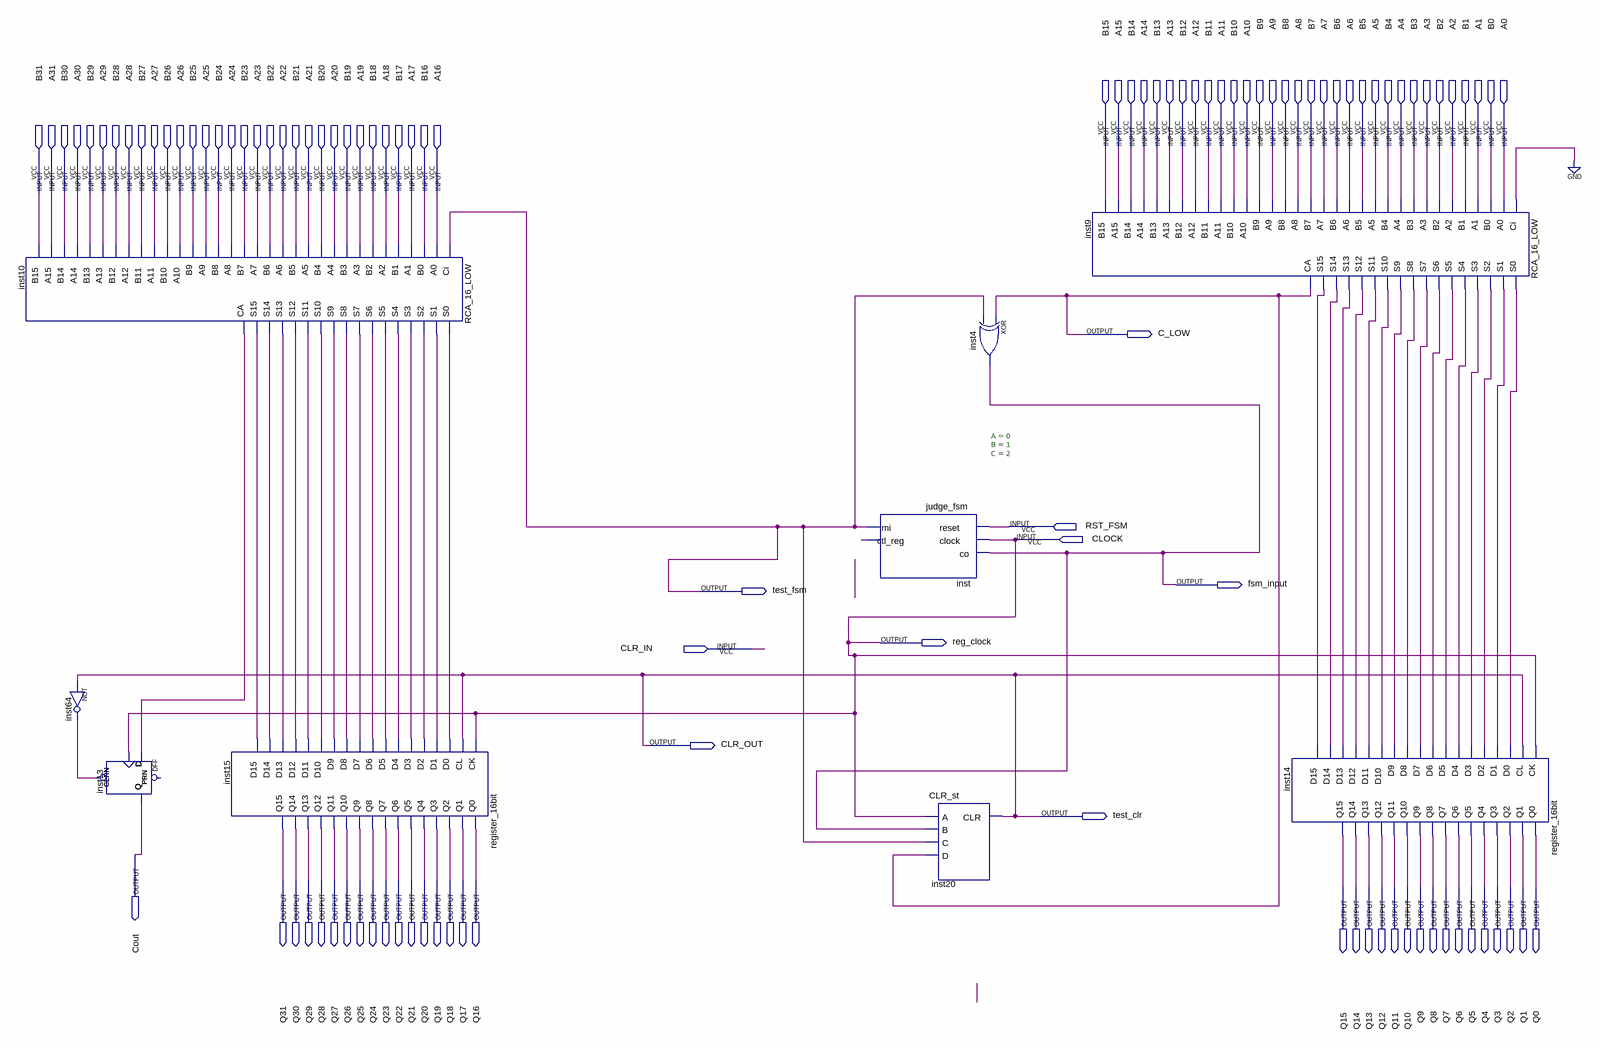
[diagram p0: schematic sheet]
// Quartus schematic test.bdf as structural Verilog: 9 symbols, 106 pins
module test (
  input  B15,
  input  A15,
  input  B14,
  input  A14,
  input  B13,
  input  A13,
  input  B12,
  input  A12,
  input  B11,
  input  A11,
  input  B10,
  input  A10,
  input  B9,
  input  A9,
  input  B8,
  input  A8,
  input  B7,
  input  A7,
  input  B6,
  input  A6,
  input  B5,
  input  A5,
  input  B4,
  input  A4,
  input  B3,
  input  A3,
  input  B2,
  input  A2,
  input  B1,
  input  A1,
  input  B0,
  input  A0,
  input  B31,
  input  A31,
  input  B30,
  input  A30,
  input  B29,
  input  A29,
  input  B28,
  input  A28,
  input  B27,
  input  A27,
  input  B26,
  input  A26,
  input  B25,
  input  A25,
  input  B24,
  input  A24,
  input  B23,
  input  A23,
  input  B22,
  input  A22,
  input  B21,
  input  A21,
  input  B20,
  input  A20,
  input  B19,
  input  A19,
  input  B18,
  input  A18,
  input  B17,
  input  A17,
  input  B16,
  input  A16,
  input  RST_FSM,
  input  CLOCK,
  input  CLR_IN,
  output C_LOW,
  output fsm_input,
  output test_fsm,
  output reg_clock,
  output CLR_OUT,
  output test_clr,
  output Cout,
  output Q31,
  output Q30,
  output Q29,
  output Q28,
  output Q27,
  output Q26,
  output Q25,
  output Q24,
  output Q23,
  output Q22,
  output Q21,
  output Q20,
  output Q19,
  output Q18,
  output Q17,
  output Q16,
  output Q15,
  output Q14,
  output Q13,
  output Q12,
  output Q11,
  output Q10,
  output Q9,
  output Q8,
  output Q7,
  output Q6,
  output Q5,
  output Q4,
  output Q3,
  output Q2,
  output Q1,
  output Q0
);

  wire inst9_s0, inst9_s1, inst9_s2, inst9_s3, inst9_s4, inst9_s5, inst9_s6, inst9_s7, inst9_s8, inst9_s9,
       inst9_s10, inst9_s11, inst9_s12, inst9_s13, inst9_s14, inst9_s15, inst10_ca, inst10_s0, inst10_s1,
       inst10_s2, inst10_s3, inst10_s4, inst10_s5, inst10_s6, inst10_s7, inst10_s8, inst10_s9, inst10_s10,
       inst10_s11, inst10_s12, inst10_s13, inst10_s14, inst10_s15, inst64_out, inst_ctl_reg;

  RCA_16_LOW inst10 (
    .Ci(test_fsm), .A0(A16), .B0(B16), .A1(A17), .B1(B17), .A2(A18), .B2(B18), .A3(A19), .B3(B19), .A4(A20),
    .B4(B20), .A5(A21), .B5(B21), .A6(A22), .B6(B22), .A7(A23), .B7(B23), .A8(A24), .B8(B24), .A9(A25),
    .B9(B25), .A10(A26), .B10(B26), .A11(A27), .B11(B27), .A12(A28), .B12(B28), .A13(A29), .B13(B29),
    .A14(A30), .B14(B30), .A15(A31), .B15(B31), .S0(inst10_s0), .S1(inst10_s1), .S2(inst10_s2),
    .S3(inst10_s3), .S4(inst10_s4), .S5(inst10_s5), .S6(inst10_s6), .S7(inst10_s7), .S8(inst10_s8),
    .S9(inst10_s9), .S10(inst10_s10), .S11(inst10_s11), .S12(inst10_s12), .S13(inst10_s13), .S14(inst10_s14),
    .S15(inst10_s15), .CA(inst10_ca));
  not inst64 (inst64_out, CLR_OUT);
  DFF inst13 (.CLRN(inst64_out), .CLK(CLOCK), .D(inst10_ca), .Q(Cout));  // open: PRN
  register_16bit inst15 (
    .CK(CLOCK), .CL(CLR_OUT), .D0(inst10_s0), .D1(inst10_s1), .D2(inst10_s2), .D3(inst10_s3), .D4(inst10_s4),
    .D5(inst10_s5), .D6(inst10_s6), .D7(inst10_s7), .D8(inst10_s8), .D9(inst10_s9), .D10(inst10_s10),
    .D11(inst10_s11), .D12(inst10_s12), .D13(inst10_s13), .D14(inst10_s14), .D15(inst10_s15), .Q0(Q16),
    .Q1(Q17), .Q2(Q18), .Q3(Q19), .Q4(Q20), .Q5(Q21), .Q6(Q22), .Q7(Q23), .Q8(Q24), .Q9(Q25), .Q10(Q26),
    .Q11(Q27), .Q12(Q28), .Q13(Q29), .Q14(Q30), .Q15(Q31));
  judge_fsm #(.A(0), .B(1), .C(2)) inst (
    .reset(RST_FSM), .clock(CLOCK), .co(fsm_input), .mi(test_fsm), .ctl_reg(inst_ctl_reg));
  CLR_st inst20 (.A(CLOCK), .B(fsm_input), .C(test_fsm), .D(C_LOW), .CLR(CLR_OUT));
  xor inst4 (fsm_input, C_LOW, test_fsm);
  RCA_16_LOW inst9 (
    .Ci(1'b0), .A0(A0), .B0(B0), .A1(A1), .B1(B1), .A2(A2), .B2(B2), .A3(A3), .B3(B3), .A4(A4), .B4(B4),
    .A5(A5), .B5(B5), .A6(A6), .B6(B6), .A7(A7), .B7(B7), .A8(A8), .B8(B8), .A9(A9), .B9(B9), .A10(A10),
    .B10(B10), .A11(A11), .B11(B11), .A12(A12), .B12(B12), .A13(A13), .B13(B13), .A14(A14), .B14(B14),
    .A15(A15), .B15(B15), .S0(inst9_s0), .S1(inst9_s1), .S2(inst9_s2), .S3(inst9_s3), .S4(inst9_s4),
    .S5(inst9_s5), .S6(inst9_s6), .S7(inst9_s7), .S8(inst9_s8), .S9(inst9_s9), .S10(inst9_s10),
    .S11(inst9_s11), .S12(inst9_s12), .S13(inst9_s13), .S14(inst9_s14), .S15(inst9_s15), .CA(C_LOW));
  register_16bit inst14 (
    .CK(CLOCK), .CL(CLR_OUT), .D0(inst9_s0), .D1(inst9_s1), .D2(inst9_s2), .D3(inst9_s3), .D4(inst9_s4),
    .D5(inst9_s5), .D6(inst9_s6), .D7(inst9_s7), .D8(inst9_s8), .D9(inst9_s9), .D10(inst9_s10),
    .D11(inst9_s11), .D12(inst9_s12), .D13(inst9_s13), .D14(inst9_s14), .D15(inst9_s15), .Q0(Q0), .Q1(Q1),
    .Q2(Q2), .Q3(Q3), .Q4(Q4), .Q5(Q5), .Q6(Q6), .Q7(Q7), .Q8(Q8), .Q9(Q9), .Q10(Q10), .Q11(Q11), .Q12(Q12),
    .Q13(Q13), .Q14(Q14), .Q15(Q15));

  assign reg_clock = CLOCK;
  assign test_clr = CLR_OUT;
endmodule
